# Altium schematic sheet microlab.SchDoc: Apothecary Microlab PCB
size A3; DocumentNumber: 1; Revision: 1.0.0; SheetNumber: 1; SheetTotal: 1
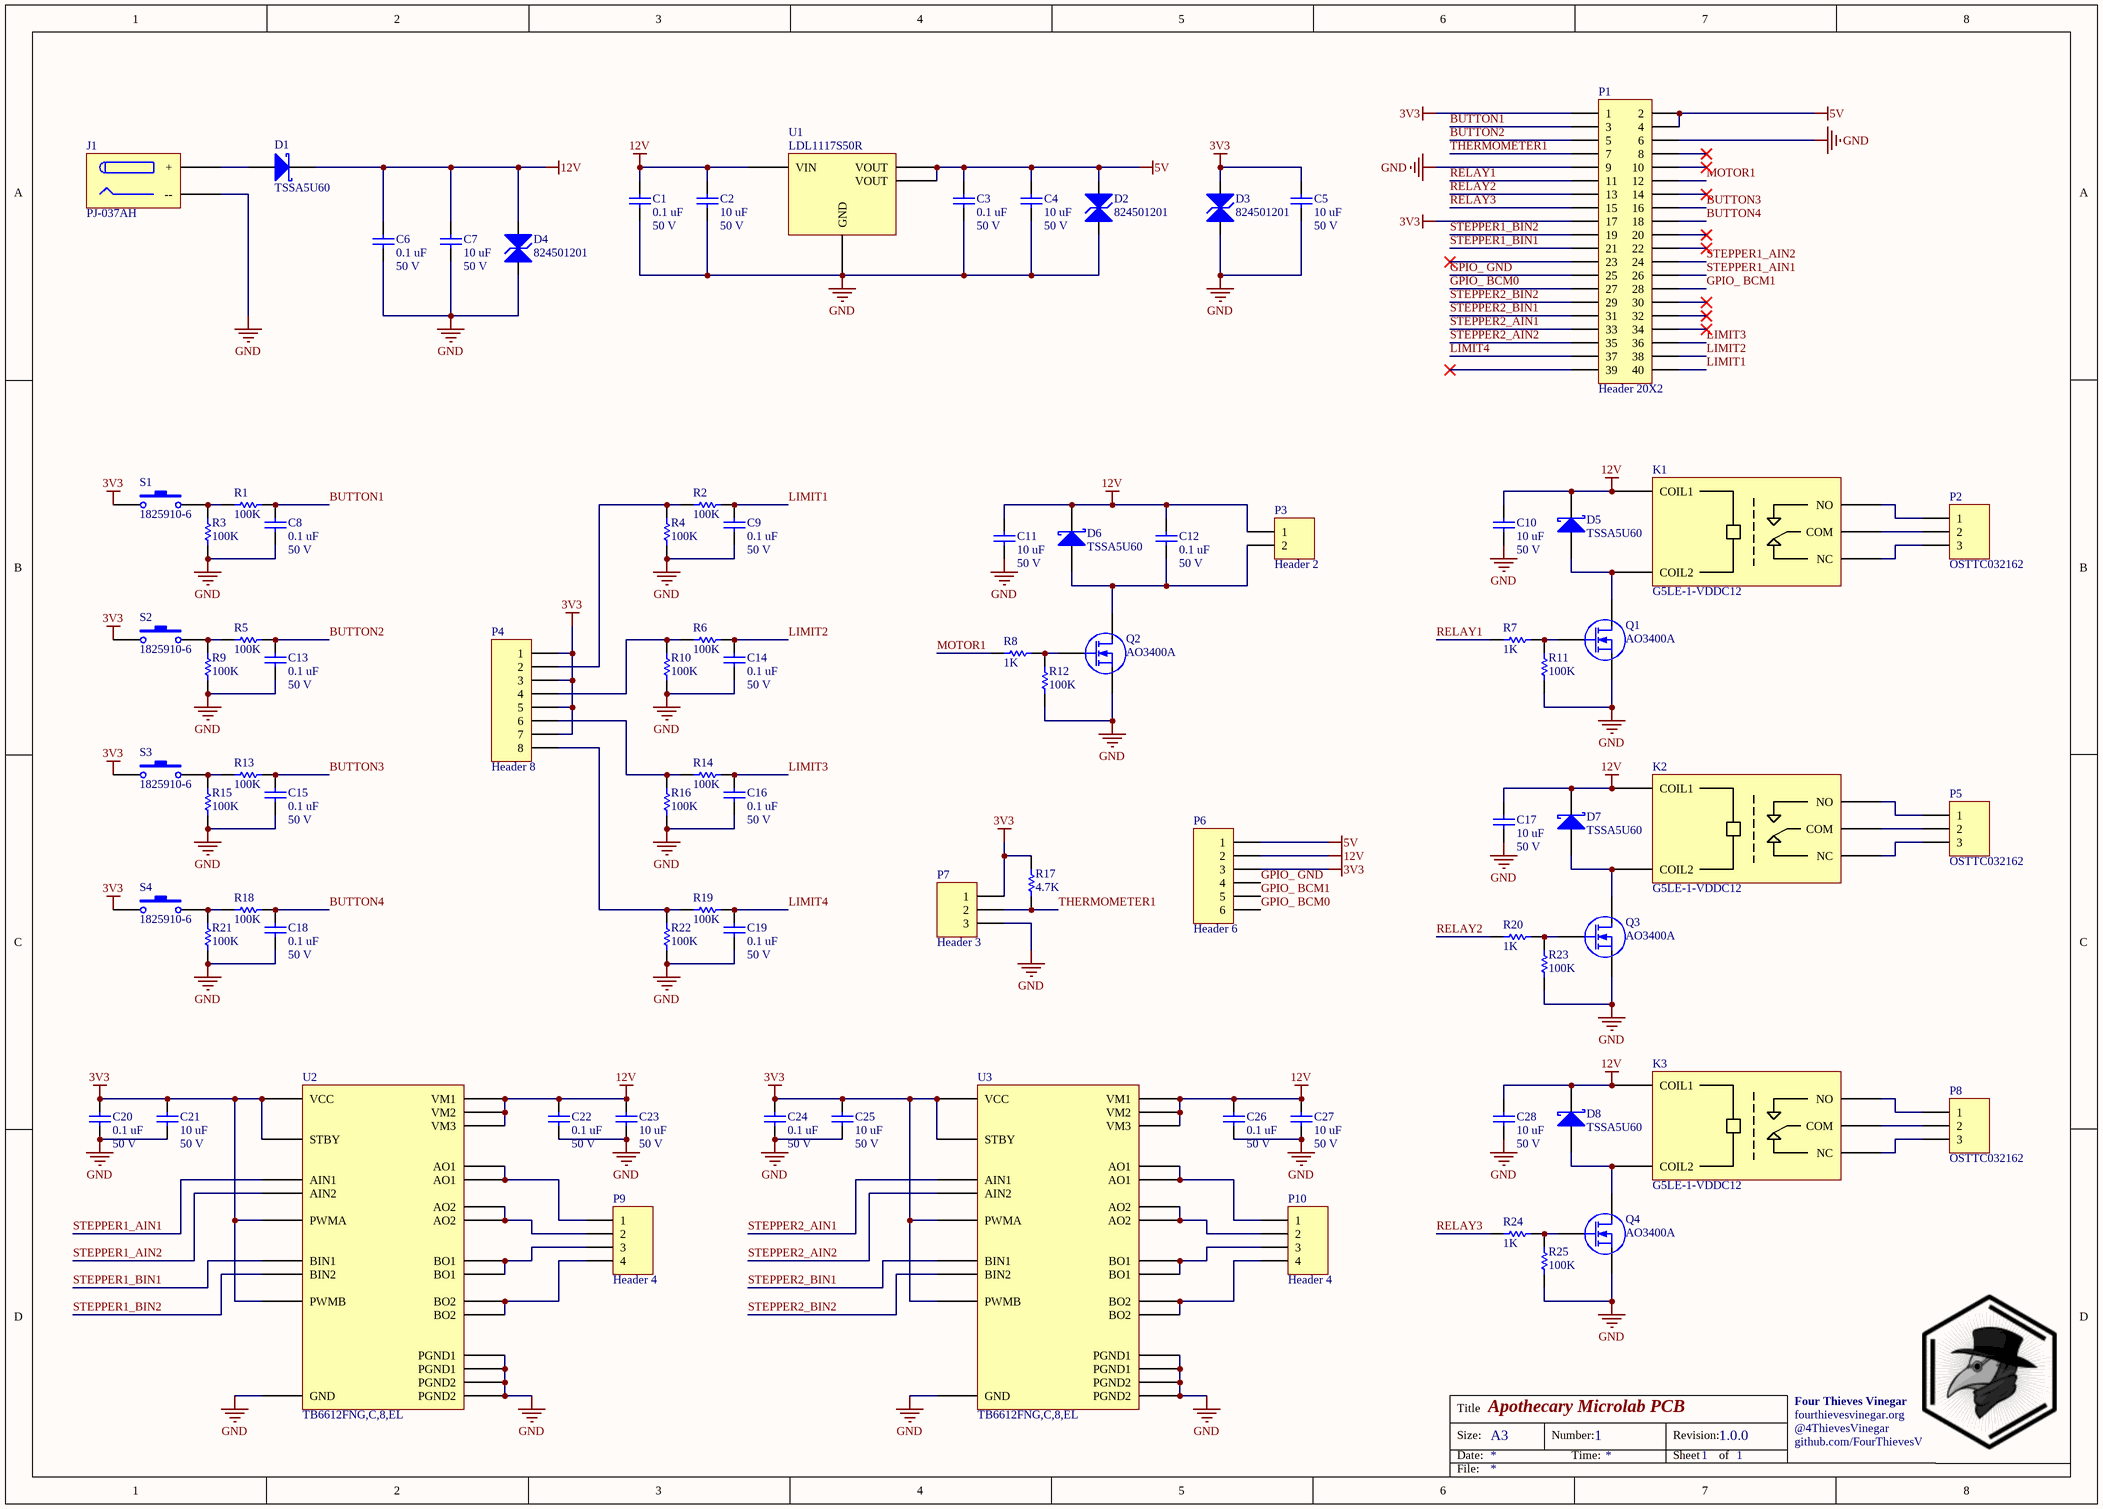
[diagram p0: microlab.SchDoc]

## Parts
C1  Voltage: 50 V  [1608[0603]]  (hidden comment: 0.1 uF)
C2  Voltage: 50 V  [C1206]  (hidden comment: 10 uF)
C3  Voltage: 50 V  [1608[0603]]  (hidden comment: 0.1 uF)
C4  Voltage: 50 V  [C1206]  (hidden comment: 10 uF)
C5  Voltage: 50 V  [C1206]  (hidden comment: 10 uF)
C6  Voltage: 50 V  [1608[0603]]  (hidden comment: 0.1 uF)
C7  Voltage: 50 V  [C1206]  (hidden comment: 10 uF)
C8  Voltage: 50 V  [1608[0603]]  (hidden comment: 0.1 uF)
C9  Voltage: 50 V  [1608[0603]]  (hidden comment: 0.1 uF)
C10  Voltage: 50 V  [C1206]  (hidden comment: 10 uF)
C11  Voltage: 50 V  [C1206]  (hidden comment: 10 uF)
C12  Voltage: 50 V  [1608[0603]]  (hidden comment: 0.1 uF)
C13  Voltage: 50 V  [1608[0603]]  (hidden comment: 0.1 uF)
C14  Voltage: 50 V  [1608[0603]]  (hidden comment: 0.1 uF)
C15  Voltage: 50 V  [1608[0603]]  (hidden comment: 0.1 uF)
C16  Voltage: 50 V  [1608[0603]]  (hidden comment: 0.1 uF)
C17  Voltage: 50 V  [C1206]  (hidden comment: 10 uF)
C18  Voltage: 50 V  [1608[0603]]  (hidden comment: 0.1 uF)
C19  Voltage: 50 V  [1608[0603]]  (hidden comment: 0.1 uF)
C20  Voltage: 50 V  [1608[0603]]  (hidden comment: 0.1 uF)
C21  Voltage: 50 V  [C1206]  (hidden comment: 10 uF)
C22  Voltage: 50 V  [1608[0603]]  (hidden comment: 0.1 uF)
C23  Voltage: 50 V  [C1206]  (hidden comment: 10 uF)
C24  Voltage: 50 V  [1608[0603]]  (hidden comment: 0.1 uF)
C25  Voltage: 50 V  [C1206]  (hidden comment: 10 uF)
C26  Voltage: 50 V  [1608[0603]]  (hidden comment: 0.1 uF)
C27  Voltage: 50 V  [C1206]  (hidden comment: 10 uF)
C28  Voltage: 50 V  [C1206]  (hidden comment: 10 uF)
D1  TSSA5U60  [SMB]
D2  824501201  [824501201]
D3  824501201  [824501201]
D4  824501201  [824501201]
D5  TSSA5U60  [SMB]
D6  TSSA5U60  [SMB]
D7  TSSA5U60  [SMB]
D8  TSSA5U60  [SMB]
J1  PJ-037AH  [PJ-037AH]
K1  G5LE-1-VDDC12  [G5LE-1-VDDC12]
K2  G5LE-1-VDDC12  [G5LE-1-VDDC12]
K3  G5LE-1-VDDC12  [G5LE-1-VDDC12]
P1  Header 20X2  [HDR2X20-centred]
P2  OSTTC032162  [OSTTC032162]
P3  Header 2  [HDR1X2]
P4  Header 8  [HDR1X8]
P5  OSTTC032162  [OSTTC032162]
P6  Header 6  [HDR1X6]
P7  Header 3  [HDR1X3]
P8  OSTTC032162  [OSTTC032162]
P9  Header 4  [HDR1X4]
P10  Header 4  [HDR1X4]
Q1  AO3400A  [AO3400A]
Q2  AO3400A  [AO3400A]
Q3  AO3400A  [AO3400A]
Q4  AO3400A  [AO3400A]
R1  100K  [J1-0603]
R2  100K  [J1-0603]
R3  100K  [J1-0603]
R4  100K  [J1-0603]
R5  100K  [J1-0603]
R6  100K  [J1-0603]
R7  1K  [J1-0603]
R8  1K  [J1-0603]
R9  100K  [J1-0603]
R10  100K  [J1-0603]
R11  100K  [J1-0603]
R12  100K  [J1-0603]
R13  100K  [J1-0603]
R14  100K  [J1-0603]
R15  100K  [J1-0603]
R16  100K  [J1-0603]
R17  4.7K  [J1-0603]
R18  100K  [J1-0603]
R19  100K  [J1-0603]
R20  1K  [J1-0603]
R21  100K  [J1-0603]
R22  100K  [J1-0603]
R23  100K  [J1-0603]
R24  1K  [J1-0603]
R25  100K  [J1-0603]
S1  1825910-6  [1825910-6]
S2  1825910-6  [1825910-6]
S3  1825910-6  [1825910-6]
S4  1825910-6  [1825910-6]
U1  LDL1117S50R  [LDL1117S50R]
U2  TB6612FNG,C,8,EL  [TB6612FNG,C,8,EL]
U3  TB6612FNG,C,8,EL  [TB6612FNG,C,8,EL]

## Nets
3V3: C5.2 C20.2 C21.2 C24.2 C25.2 D3.2(K) P1.1 P1.17 P4.1 P4.3 P4.5 P4.7 P6.3 P7.1 R17.2 S1.1 S2.1 S3.1 S4.1 U2.15(PWMB) U2.19(STBY) U2.20(VCC) U2.23(PWMA) U3.15(PWMB) U3.19(STBY) U3.20(VCC) U3.23(PWMA)
5V: C3.2 C4.2 D2.2(K) P1.2 P1.4 P6.1 U1.2(VOUT) U1.4(VOUT)
12V: C1.2 C2.2 C6.2 C7.2 C10.2 C11.2 C12.2 C17.2 C22.2 C23.2 C26.2 C27.2 C28.2 D1.2(K) D4.2(K) D5.2(K) D6.2(K) D7.2(K) D8.2(K) K1.2(COIL1) K2.2(COIL1) K3.2(COIL1) P3.1 P6.2 U1.3(VIN) U2.13(VM2) U2.14(VM3) U2.24(VM1) U3.13(VM2) U3.14(VM3) U3.24(VM1)
GND: C1.1 C2.1 C3.1 C4.1 C5.1 C6.1 C7.1 C8.1 C9.1 C10.1 C11.1 C13.1 C14.1 C15.1 C16.1 C17.1 C18.1 C19.1 C20.1 C21.1 C22.1 C23.1 C24.1 C25.1 C26.1 C27.1 C28.1 D2.1(A) D3.1(A) D4.1(A) J1.2(--) P1.6 P1.9 P7.3 Q1.S Q2.S Q3.S Q4.S R3.1 R4.1 R9.1 R10.1 R11.1 R12.1 R15.1 R16.1 R21.1 R22.1 R23.1 R25.1 U1.1(GND) U2.3(PGND1) U2.4(PGND1) U2.9(PGND2) U2.10(PGND2) U2.18(GND) U3.3(PGND1) U3.4(PGND1) U3.9(PGND2) U3.10(PGND2) U3.18(GND)
BUTTON1: C8.2 P1.3 R1.1
BUTTON2: C13.2 P1.5 R5.1
BUTTON3: C15.2 P1.16 R13.1
BUTTON4: C18.2 P1.18 R18.1
GPIO_ BCM0: P1.27 P6.6
GPIO_ BCM1: P1.28 P6.5
GPIO_ GND: P1.25 P6.4
LIMIT1: C9.2 P1.40 R2.1
LIMIT2: C14.2 P1.38 R6.1
LIMIT3: C16.2 P1.36 R14.1
LIMIT4: C19.2 P1.37 R19.1
MOTOR1: P1.12 R8.2
RELAY1: P1.11 R7.2
RELAY2: P1.13 R20.2
RELAY3: P1.15 R24.2
STEPPER1_AIN1: P1.26 U2.21(AIN1)
STEPPER1_AIN2: P1.24 U2.22(AIN2)
STEPPER1_BIN1: P1.21 U2.17(BIN1)
STEPPER1_BIN2: P1.19 U2.16(BIN2)
STEPPER2_AIN1: P1.33 U3.21(AIN1)
STEPPER2_AIN2: P1.35 U3.22(AIN2)
STEPPER2_BIN1: P1.31 U3.17(BIN1)
STEPPER2_BIN2: P1.29 U3.16(BIN2)
THERMOMETER1: P1.7 P7.2 R17.1
NetC12_1: C12.1 D6.1(A) P3.2 Q2.D
NetD1_1: D1.1(A) J1.1(+)
NetD5_1: D5.1(A) K1.5(COIL2) Q1.D
NetD7_1: D7.1(A) K2.5(COIL2) Q3.D
NetD8_1: D8.1(A) K3.5(COIL2) Q4.D
NetK1_1: K1.1(COM) P2.2
NetK1_3: K1.3(NO) P2.1
NetK1_4: K1.4(NC) P2.3
NetK2_1: K2.1(COM) P5.2
NetK2_3: K2.3(NO) P5.1
NetK2_4: K2.4(NC) P5.3
NetK3_1: K3.1(COM) P8.2
NetK3_3: K3.3(NO) P8.1
NetK3_4: K3.4(NC) P8.3
NetP4_2: P4.2 R2.2 R4.2
NetP4_4: P4.4 R6.2 R10.2
NetP4_6: P4.6 R14.2 R16.2
NetP4_8: P4.8 R19.2 R22.2
NetP9_1: P9.1 U2.1(AO1) U2.2(AO1)
NetP9_2: P9.2 U2.5(AO2) U2.6(AO2)
NetP9_3: P9.3 U2.11(BO1) U2.12(BO1)
NetP9_4: P9.4 U2.7(BO2) U2.8(BO2)
NetP10_1: P10.1 U3.1(AO1) U3.2(AO1)
NetP10_2: P10.2 U3.5(AO2) U3.6(AO2)
NetP10_3: P10.3 U3.11(BO1) U3.12(BO1)
NetP10_4: P10.4 U3.7(BO2) U3.8(BO2)
NetQ1_G: Q1.G R7.1 R11.2
NetQ2_G: Q2.G R8.1 R12.2
NetQ3_G: Q3.G R20.1 R23.2
NetQ4_G: Q4.G R24.1 R25.2
NetR1_2: R1.2 R3.2 S1.2
NetR5_2: R5.2 R9.2 S2.2
NetR13_2: R13.2 R15.2 S3.2
NetR18_2: R18.2 R21.2 S4.2

Not connected (* = marked no-connect by the designer): P1 8* 10* 14* 20* 22* 23* 30* 32* 34* 39*

## Notes on the sheet
- Title
- Size:
- Date:
- A3
- Number:
- Time:
- Revision:
- Sheet
- of
- Four Thieves Vinegar
- fourthievesvinegar.org
- @4ThievesVinegar
- github.com/FourThievesVinegar
- File:

## Library data of the parts
C1 C3 C6 C8 C9 C12-C16 C18-C20 C22 C24 C26 = Cap Semi: Capacitor (Semiconductor SIM Model); Published: 8-Jun-2000; LatestRevisionDate: 29-May-2009; LatestRevisionNote: IPC-7351 Footprint Added.; PackageReference: C1206; Publisher: Altium Limited; PackageDescription: Chip Capacitor; Value: 0.1 uF
C2 C4 C5 C7 C10 C11 C17 C21 C23 C25 C27 C28 = Cap Semi: CL31A106KBHNNNE; Published: 8-Jun-2000; LatestRevisionDate: 29-May-2009; LatestRevisionNote: IPC-7351 Footprint Added.; PackageReference: C1206; Publisher: Altium Limited; PackageDescription: Chip Capacitor; Value: 10 uF
D1 D5-D8 = D Schottky: Schottky Diode; Published: 8-Jun-2000; LatestRevisionDate: 17-Jul-2002; LatestRevisionNote: Re-released for DXP Platform.; PackageReference: SMB; Publisher: Altium Limited; PackageDescription: DO-214-AA/SMB; 2 C-Bend Leads; Body 5.3 x 3.6 mm, inc. leads (LxW); Code_JEDEC: DO-214-AA
D2-D4 = 824501201: TVS DIODE 20V 32.4V DO214AC; Digikey: 732-9954-1-ND
J1 = PJ-037AH: CONN PWR JACK 2X5.5MM SOLDER; Digikey: CP-037AH-ND
K1-K3 = G5LE-1-VDDC12: RELAY GEN PURPOSE SPDT 10A 12V; Digikey: Z3672-ND
P1 = Header 20X2: Header, 20-Pin, Dual row; LatestRevisionDate: 17-Jul-2002; LatestRevisionNote: Re-released for DXP Platform.; Publisher: Altium Limited
P2 P5 P7 P8 = Header 3: Header, 3-Pin; LatestRevisionDate: 17-Jul-2002; LatestRevisionNote: Re-released for DXP Platform.; Publisher: Altium Limited
  P2 P5 P8: Digikey: ED2610-ND
P3 = Header 2: Header, 2-Pin; LatestRevisionDate: 17-Jul-2002; LatestRevisionNote: Re-released for DXP Platform.; Publisher: Altium Limited
P4 = Header 8: Header, 8-Pin; LatestRevisionDate: 17-Jul-2002; LatestRevisionNote: Re-released for DXP Platform.; Publisher: Altium Limited
P6 = Header 6: Header, 6-Pin; LatestRevisionDate: 17-Jul-2002; LatestRevisionNote: Re-released for DXP Platform.; Publisher: Altium Limited
P9 P10 = Header 4: Header, 4-Pin; LatestRevisionDate: 17-Jul-2002; LatestRevisionNote: Re-released for DXP Platform.; Publisher: Altium Limited
Q1-Q4 = AO3400A: MOSFET N-CH 30V 5.7A SOT23; Digikey: 785-1000-1-ND
R1-R25 = Res1: Resistor; Published: 8-Jun-2000; LatestRevisionDate: 17-Jul-2002; LatestRevisionNote: Re-released for DXP Platform.; PackageReference: AXIAL-0.3; Publisher: Altium Limited; PackageDescription: Axial Device, Thru-Hole; 2 Leads; 0.3 in Pin Spacing
  R1-R6 R9-R16 R18 R19 R21-R23 R25: Value: 100K
  R7 R8 R20 R24: Value: 1K
  R17: Value: 4.7K
S1-S4 = SW-PB: SWITCH TACTILE SPST-NO 0.05A 24V; Published: 24-Mar-1999; LatestRevisionDate: 17-Jul-2002; LatestRevisionNote: Re-released for DXP Platform.; PackageReference: SPST-2; Publisher: Altium Limited; PackageDescription: Switch; 2 Leads; Digikey: 450-1650-ND
U1 = LDL1117S50R: IC REG LINEAR 5V 1.2A SOT223; Digikey: 497-17240-1-ND
U2 U3 = TB6612FNG,C,8,EL: IC MOTOR DRIVER PAR 24SSOP; Digikey: TB6612FNGC8ELCT-ND